# EAGLE schematic Halloween2017 (EAGLE 8.3.2)
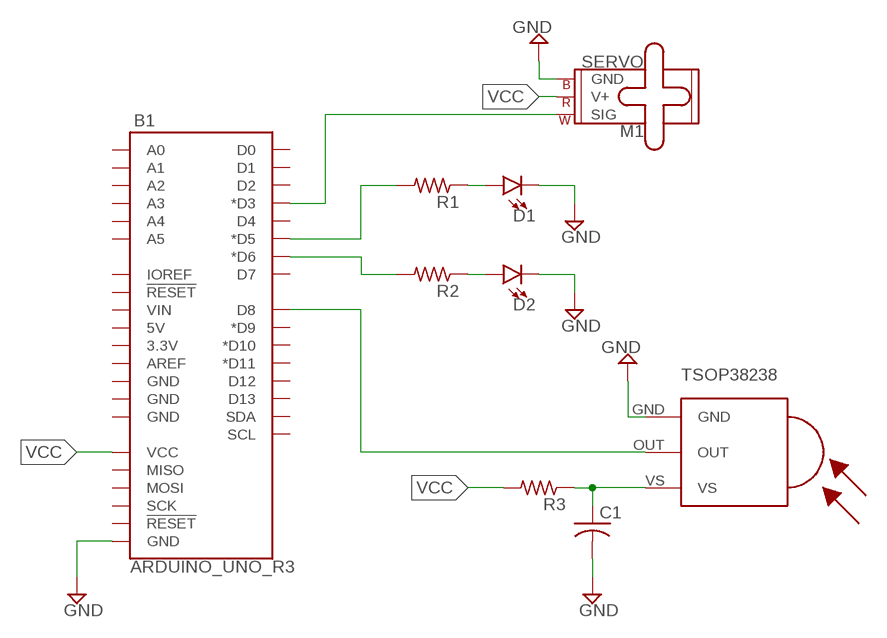
[diagram p0: schematic, sheet 1]

## Parts
B1  ARDUINO_UNO_R3  [ARDUINO_R3]
C1  C-US025-040X050  [C025-040X050]
D1  LED5MM  [LED_5MM]
D2  LED5MM  [LED_5MM]
M1  SERVO  [1X03]
R1  R-US_0309/10  [0309/10]
R2  R-US_0309/10  [0309/10]
R3  R-US_0309/10  [0309/10]
TSOP38238  TSOP38238  [TSOP-382]

## Nets
GND: B1.GND@1(GND) C1.2 D1.K(C) D2.K(C) M1.3(GND) TSOP38238.GND
N$1: D1.A R1.1
N$2: D2.A R2.1
N$3: C1.1 R3.1 TSOP38238.VS
N$4: B1.D3(*D3) M1.1(SIG)
N$5: B1.D5(*D5) R1.2
N$6: B1.D6(*D6) R2.2
N$7: B1.D8 TSOP38238.OUT
VCC: B1.VCC M1.2(V+) R3.2
Unconnected: B1.3.3V B1.5V B1.A0 B1.A1 B1.A2 B1.A3 B1.A4 B1.A5 B1.AREF B1.D0 B1.D1 B1.D2 B1.D4 B1.D7 B1.D9(*D9) B1.D10(*D10) B1.D11(*D11) B1.D12 B1.D13 B1.GND@2(GND) B1.GND@3(GND) B1.GND@4(GND) B1.IOREF B1.MISO B1.MOSI B1.RESET@1(!RESET!) B1.RESET@2(!RESET!) B1.SCK B1.SCL B1.SDA B1.VIN

## Library data of the parts
B1 = SparkFun-Boards:ARDUINO_UNO_R3: Arduino R3 Footprint with SPI header Arduino Uno R3 Compatible Footprint. Matches PCB size of the original board. SparkFun Products: SAMD21 Dev Breakout <https://www.sparkfun.com/products/13672> RedBoard <https://www.sparkfun.com/products/12757> R3 Stackable Headers <https://www.sparkfun.com/products/11417>
C1 = adafruit:C-US: CAPACITOR, American symbol
D1 D2 = SparkFun-LED:LED: LED (Generic) Standard schematic elements and footprints for 5mm, 3mm, 1206, and 0603 sized LEDs. Generic LEDs with no color specified.
M1 = SparkFun-Electromechanical:SERVO: Servo Motor 3-pin connector for a standard servo motor (voltage supply, ground, and control signal.) SparkFun Products Servo - Generic (Sub-Micro Size) <https://www.sparkfun.com/products/9065> (ROB-09065) Servo - Generic High Torque Continuous Rotation (Standard Size) <https://www.sparkfun.com/products/9347> (ROB-09347) Servo - Generic High Torque (Standard Size) <https://www.sparkfun.com/products/11965> (ROB-11965)
R1-R3 = adafruit:R-US_: RESISTOR, American symbol
TSOP38238 = TSOP38238:TSOP38238: 38 kHz 45 m 2.5-5.5 V Through Hole IR Receiver Module for Remote Control System; AVAILABILITY: Good; DESCRIPTION: 38 kHz 45 m 2.5-5.5 V Through Hole IR Receiver Module for Remote Control System; MF: Vishay; MP: TSOP38238; PACKAGE: None; PRICE: 0.52 USD